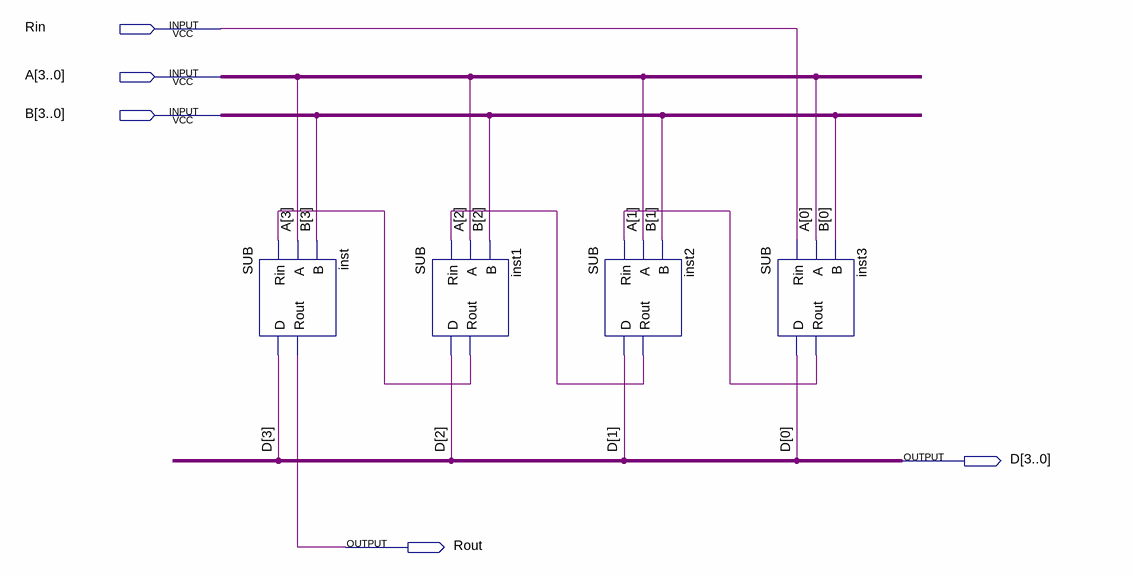
[diagram p0: schematic sheet]
// Quartus schematic SUB4bit.bdf as structural Verilog: 4 symbols, 5 pins
module SUB4bit (
  input  Rin,
  input  [3:0] A,
  input  [3:0] B,
  output [3:0] D,
  output Rout
);

  wire inst1_rout, inst2_rout, inst3_rout;

  SUB inst (.Rin(inst1_rout), .A(A[3]), .B(B[3]), .D(D[3]), .Rout(Rout));
  SUB inst1 (.Rin(inst2_rout), .A(A[2]), .B(B[2]), .D(D[2]), .Rout(inst1_rout));
  SUB inst2 (.Rin(inst3_rout), .A(A[1]), .B(B[1]), .D(D[1]), .Rout(inst2_rout));
  SUB inst3 (.Rin(Rin), .A(A[0]), .B(B[0]), .D(D[0]), .Rout(inst3_rout));
endmodule
